# Altium schematic sheet RJ45_Sheet.SchDoc
size 420 x 297 mm; SheetNumber: 11; SheetTotal: 14
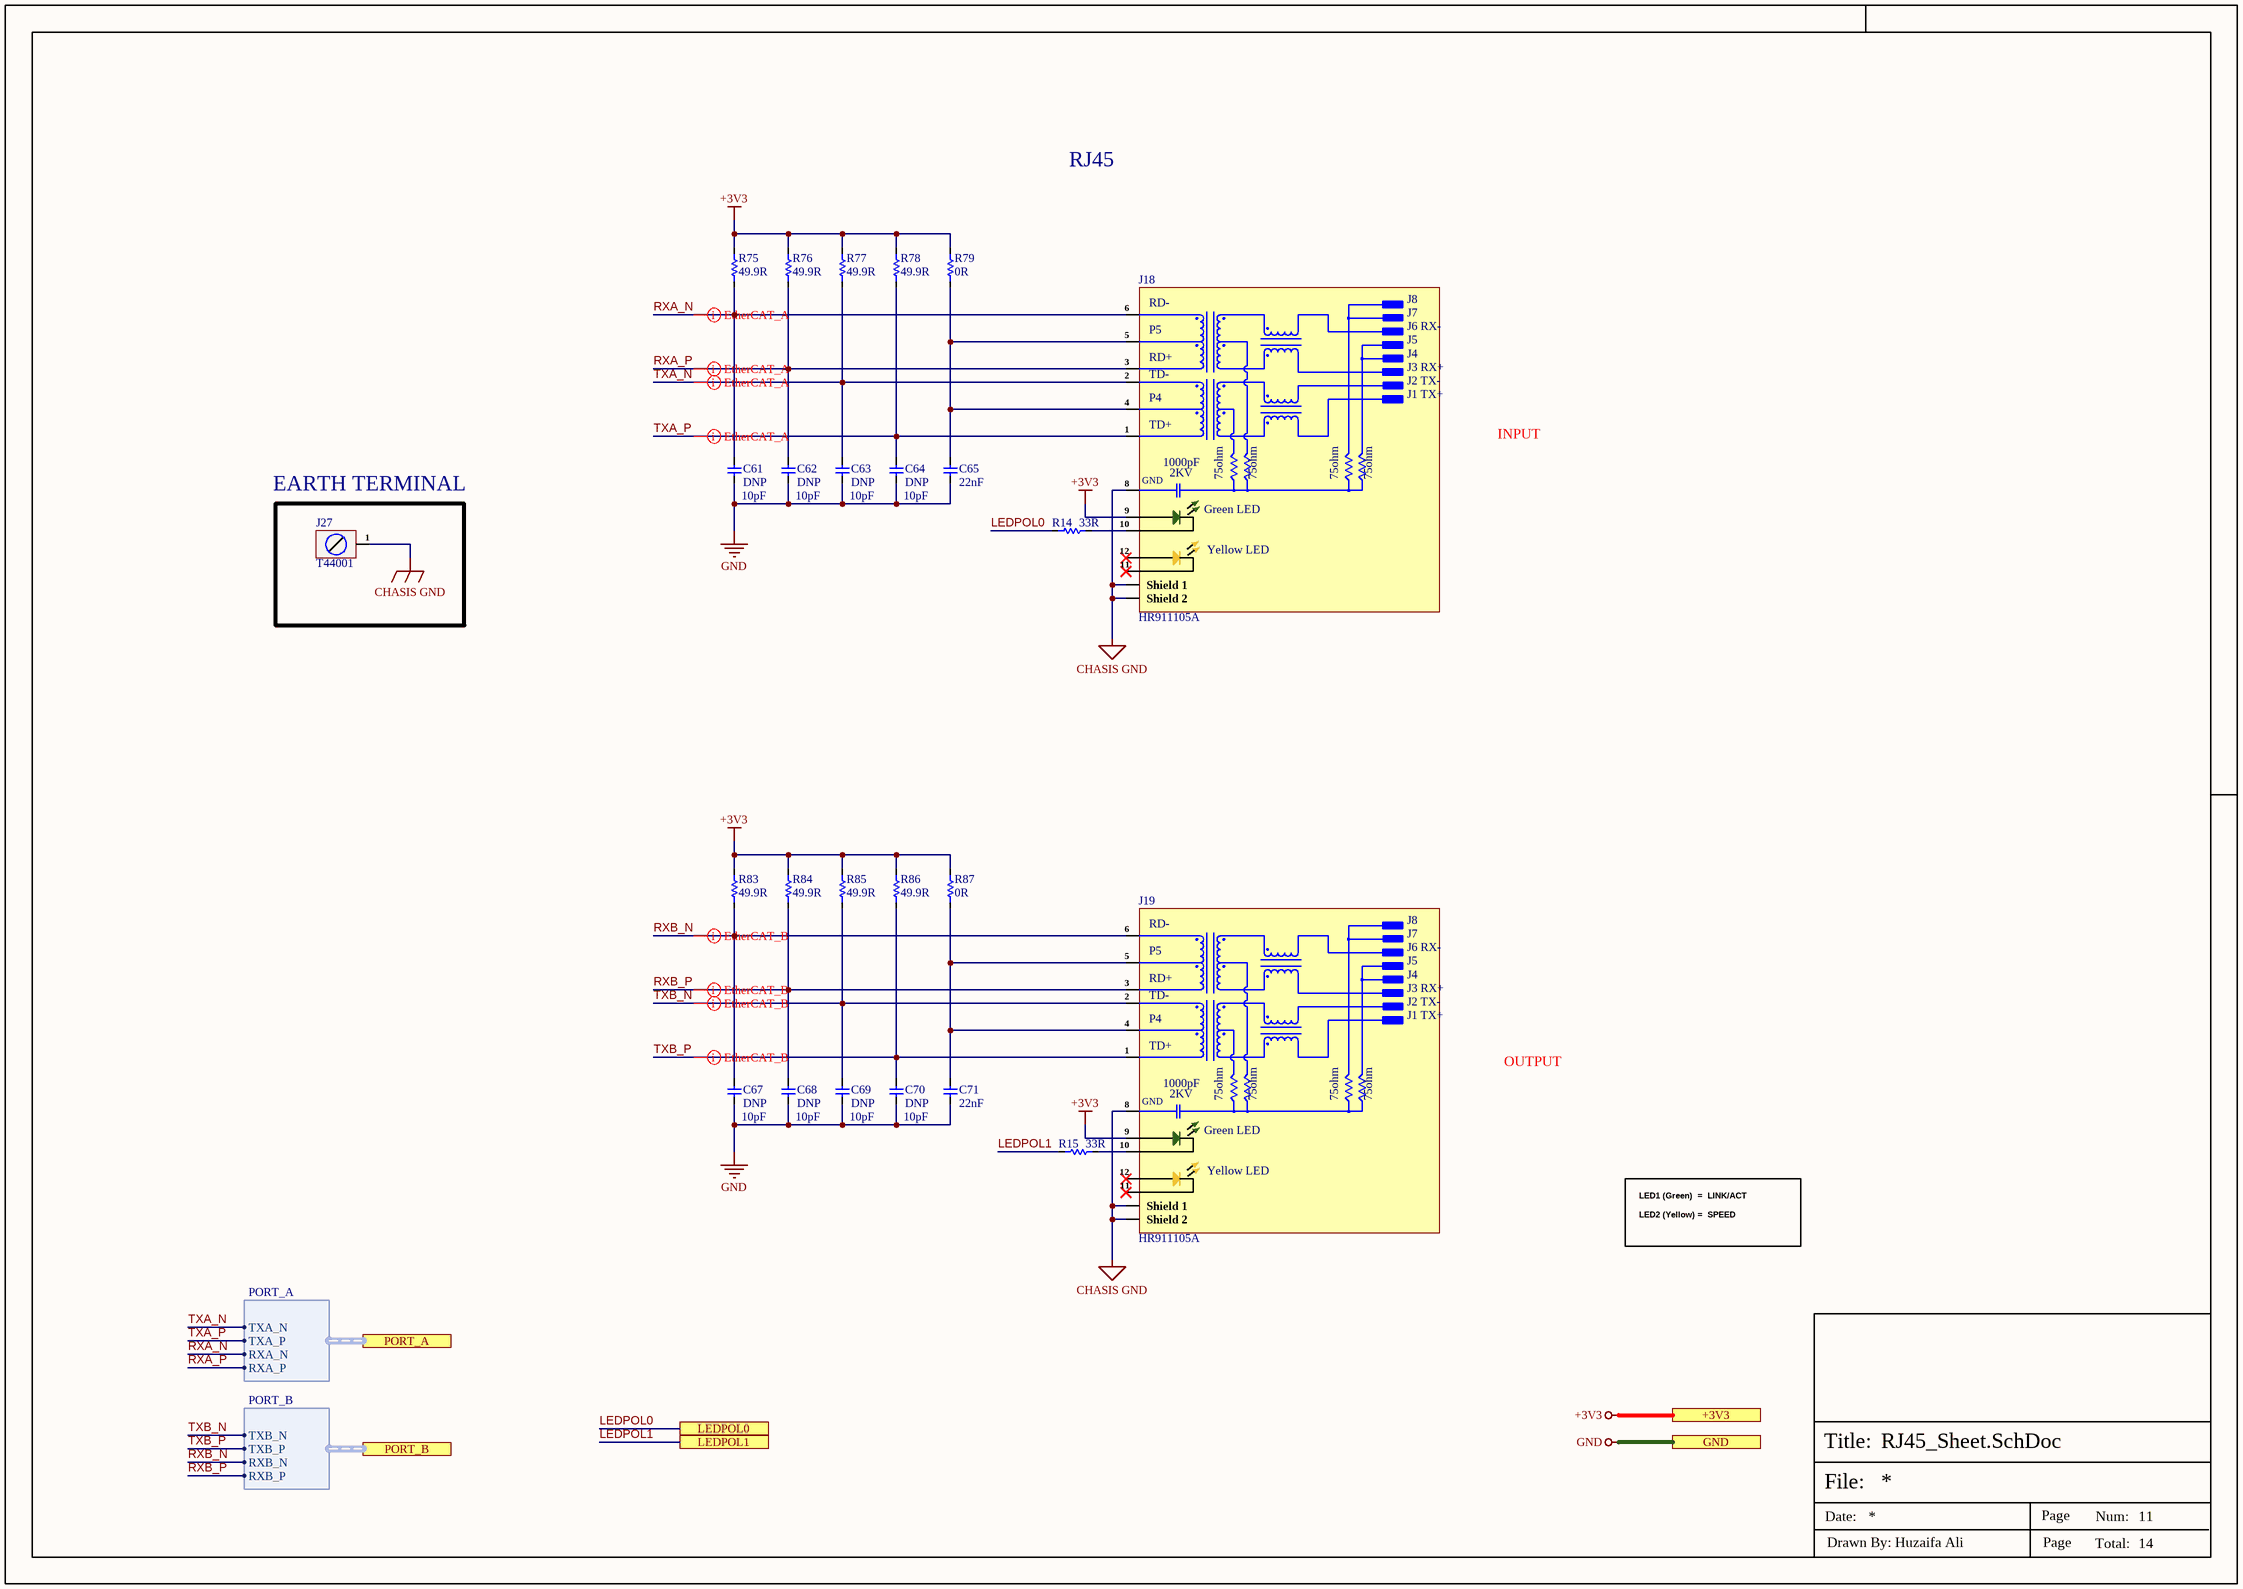
[diagram p0: RJ45_Sheet.SchDoc]

## Parts
C61  DNP  [Cap-0402]
C62  DNP  [Cap-0402]
C63  DNP  [Cap-0402]
C64  DNP  [Cap-0402]
C65  22nF  [Cap-0402]
C67  DNP  [Cap-0402]
C68  DNP  [Cap-0402]
C69  DNP  [Cap-0402]
C70  DNP  [Cap-0402]
C71  22nF  [Cap-0402]
J18  HR911105A  [HR911105A]
J19  HR911105A  [HR911105A]
J27  T44001  [T44001]
R14  33R  [Res-0402]
R15  33R  [Res-0402]
R75  49.9R  [Res-0603]
R76  49.9R  [Res-0603]
R77  49.9R  [Res-0603]
R78  49.9R  [Res-0603]
R79  0R  [Res-0402]
R83  49.9R  [Res-0603]
R84  49.9R  [Res-0603]
R85  49.9R  [Res-0603]
R86  49.9R  [Res-0603]
R87  0R  [Res-0402]

## Ports
+3V3 (see Top_Sheet[1B], CAN_Sheet[5D], Controller_Sheet[5D], EtherCAT_Sheet[5D], GPIO_EXPANDER_Sheet[5D], Power_Sheet[5D], RS485_RS232_Sheet[2D], Stepper_Driver_Sheet1[5D], Stepper_Driver_Sheet2[5D], Stepper_Driver_Sheet3[5D], Stepper_Driver_Sheet4[5D]), GND (see Top_Sheet[1B], CAN_Sheet[5D], Connector_Sheet[5D], Controller_Sheet[5D], DIO_Isolation_Sheet[5D], EtherCAT_Sheet[5D], GPIO_EXPANDER_Sheet[5D], Power_Sheet[5D], RS485_RS232_Sheet[2D], Stepper_Driver_Sheet1[5D], Stepper_Driver_Sheet2[5D], Stepper_Driver_Sheet3[5D], Stepper_Driver_Sheet4[5D]), LEDPOL0 (see Top_Sheet[2B], EtherCAT_Sheet[1D]), LEDPOL1 (see Top_Sheet[2B], EtherCAT_Sheet[1D]), PORT_A (harness PORT_A, see Top_Sheet[2B], EtherCAT_Sheet[2D]), PORT_B (harness PORT_B, see Top_Sheet[2B], EtherCAT_Sheet[2D])

## Harnesses
PORT_A: TXA_N, TXA_P, RXA_N, RXA_P
PORT_B: TXB_N, TXB_P, RXB_N, RXB_P

## Nets
+3V3: J18.9(ANODE) J19.9(ANODE) R75.2 R76.2 R77.2 R78.2 R79.2 R83.2 R84.2 R85.2 R86.2 R87.2 ; port +3V3
CHASIS GND: J18.8(GND) J18.Shield_1 J18.Shield_2 J19.8(GND) J19.Shield_1 J19.Shield_2 J27.1
GND: C61.1 C62.1 C63.1 C64.1 C65.1 C67.1 C68.1 C69.1 C70.1 C71.1 ; port GND
LEDPOL0: R14.1 ; port LEDPOL0
LEDPOL1: R15.1 ; port LEDPOL1
RXA_N: C61.2 J18.6(RD-) R75.1 ; port PORT_A.RXA_N
RXA_P: C62.2 J18.3(RD+) R76.1 ; port PORT_A.RXA_P
RXB_N: C67.2 J19.6(RD-) R83.1 ; port PORT_B.RXB_N
RXB_P: C68.2 J19.3(RD+) R84.1 ; port PORT_B.RXB_P
TXA_N: C63.2 J18.2(TD-) R77.1 ; port PORT_A.TXA_N
TXA_P: C64.2 J18.1(TD+) R78.1 ; port PORT_A.TXA_P
TXB_N: C69.2 J19.2(TD-) R85.1 ; port PORT_B.TXB_N
TXB_P: C70.2 J19.1(TD+) R86.1 ; port PORT_B.TXB_P
NetC65_2: C65.2 J18.4(P4) J18.5(P5) R79.1
NetC71_2: C71.2 J19.4(P4) J19.5(P5) R87.1
NetJ18_10: J18.10(CATHODE) R14.2
NetJ19_10: J19.10(CATHODE) R15.2

Not connected (* = marked no-connect by the designer): J18 11(CATHODE)* 12(ANODE_)*; J19 11(CATHODE)* 12(ANODE_)*

## Layout directives
differential pair; differential pair class EtherCAT_B_Lines; net class EtherCAT_B; rule Matched Net Lengths [Tolerance = 25.4mil]; rule Impedance Constraint [Min = 85.00    Max = 95.00    ]: RXB_N, RXB_P, TXB_N, TXB_P
differential pair; differential pair class EtherCAT_A_Lines; net class EtherCAT_A; rule Matched Net Lengths [Tolerance = 25.4mil]; rule Impedance Constraint [Min = 85.00    Max = 95.00    ]: RXA_N, RXA_P, TXA_N, TXA_P

## Notes on the sheet
- RJ45
- INPUT
- (near J27) EARTH TERMINAL
- 10pF
- OUTPUT
- LED1 (Green)  =  LINK/ACT
  LED2 (Yellow) =  SPEED
- File:
- Title:
- Date:
- Page
- Num:
- Total:
- Drawn By: Huzaifa Ali
- (in symbol HR911105A) J8; J7; J6 RX-; J5; J4; J3 RX+; J2 TX-; J1 TX+; 1000pF; 2KV; 75ohm; Green LED; Yellow LED

## Library data of the parts
C61-C64 C67-C70 = GRM1555C1H100JA01D: CAP CER 10PF 50V C0G/NP0 0402; Manufacturer: Murata; Material: Ceramic; Dielectric: C0G; Tolerance: 5%; Item Type: Capacitor; Supplier: Arrow Electronics; Supplier Part Number: GRM1555C1H100JA01D; Manufacturer Part Number: GRM1555C1H100JA01D; RoHS: Yes; Category: Ceramic Capacitors; Stock: 3860000; Pricing: 10000=0.0034, 50000=0.0027, 100000=0.0023, 250000=0.0021 (USD); Mounting Technology: Surface Mount; Case/Package: 0402; Case Code (Metric): 1005; Case Code (Imperial): 0402; Min Operating Temperature: -55°C; Max Operating Temperature: 125°C; Value: 10pF; Voltage Rating: 50V; Packaging: Tape and Reel; Package Quantity: 1; Voltage Rating (DC): 50V; Termination: SMD/SMT; Series: GRM; Voltage: 50V; Construction: Flat; Length: 1mm; Width: 0.02inch; Height: 0.5mm; Depth: 0.5mm; Thickness: 0.022inch; Radiation Hardening: No; RoHS Compliant: Yes; Lead Free: Lead Free; Reach SVHC Compliant: No; ComponentLink1URL: https://datasheet.ciiva.com/2989/product-2989280.pdf?src-supplier=Avnet; ComponentLink1Description: https://datasheet.ciiva.com/2989/product-2989280.pdf?src-supplier=Avnet; ComponentLink2URL: https://datasheet.ciiva.com/18184/getdatasheetpartid-307234-18184164.pdf?src-supplier=Verical; ComponentLink2Description: https://datasheet.ciiva.com/18184/getdatasheetpartid-307234-18184164.pdf?src-supplier=Verical; ComponentLink3URL: https://datasheet.ciiva.com/29200/453545-da-01-en-vs-kondensator-0402-29200107.pdf?src-supplier=Conrad; ComponentLink3Description: https://datasheet.ciiva.com/29200/453545-da-01-en-vs-kondensator-0402-29200107.pdf?src-supplier=Conrad; ComponentLink4URL: https://datasheet.ciiva.com/7828/1666664-7828812.pdf?src-supplier=Element14; ComponentLink4Description: https://datasheet.ciiva.com/7828/1666664-7828812.pdf?src-supplier=Element14; ComponentLink5URL: https://datasheet.ciiva.com/6271/partnumbering-e-01-6271159.pdf?src-supplier=Digi-Key; ComponentLink5Description: https://datasheet.ciiva.com/6271/partnumbering-e-01-6271159.pdf?src-supplier=Digi-Key; ComponentLink6URL: https://datasheet.ciiva.com/6271/partnumbering-e-01-6271158.pdf?src-supplier=Digi-Key; ComponentLink6Description: https://datasheet.ciiva.com/6271/partnumbering-e-01-6271158.pdf?src-supplier=Digi-Key; ComponentLink7URL: https://datasheet.ciiva.com/6271/partnumbering-e-01-6271068.pdf?src-supplier=Digi-Key; ComponentLink7Description: https://datasheet.ciiva.com/6271/partnumbering-e-01-6271068.pdf?src-supplier=Digi-Key; LCSC Part Number: C76946
C65 C71 = CC0402JRX7R7BB223: CAP CER 0.022UF 16V X7R 0402; Manufacturer: Yageo; Tolerance: 5%; Item Type: Capacitor; Supplier: Digikey; Supplier Part Number: 311-3758-1-ND; Manufacturer Part Number: CC0402JRX7R7BB223; RoHS: Yes; Category: Ceramic Capacitors; Stock: 4203; Pricing: 1=0.1, 10=0.033, 50=0.0192, 100=0.0149, 500=0.0112, 1000=0.0088, 2500=0.008, 5000=0.00736 (USD); Mounting Technology: Surface Mount; Case/Package: 0402; Case Code (Imperial): 0402; Case Code (Metric): 1005; Weight: 2.3E-05oz; Min Operating Temperature: -55°C; Max Operating Temperature: 125°C; Value: 22nF; Packaging: Tape and Reel; Voltage Rating: 16V; Voltage Rating (DC): 16V; Dielectric: X7R; Termination: SMD/SMT; Series: CC; Length: 0.039inch; Width: 0.5mm; Thickness: 0.022inch; RoHS Compliant: Yes; Halogen Free: 5694HalogenFree; Lead Free: 5697LeadFree; ComponentLink1URL: https://datasheet.ciiva.com/13264/upy-gphc-x7r-6-3v-to-50v-8-12304-13264039.pdf?src-supplier=Mouser; ComponentLink1Description: https://datasheet.ciiva.com/13264/upy-gphc-x7r-6-3v-to-50v-8-12304-13264039.pdf?src-supplier=Mouser; LCSC Part Number: C541459
J18 J19 = HR911105A: RJ45 RJReceptacle 1 WithLED Plugin Ethernet Connectors/Modular Connectors (RJ45 RJ11) ROHS; Manufacturer: HANRUN; Item Type: RJ45 Connector; Manufacturer Part Number: HR911105A; Package: Plugin; LCSC Part Number: C12074; ComponentLink1Description: LCSC; ComponentLink1URL: https://www.lcsc.com/product-detail/Ethernet-Connectors-Modular-Connectors-RJ45-RJ11_HANRUN-Zhongshan-HanRun-Elec-HR911105A_C12074.html
J27 = T44001: M4 Plugin PCB Welding Terminal ROHS; Manufacturer: XFCN; Manufacturer Part Number: T44001; Package: Plugin; ComponentLink1Description: LCSC; ComponentLink1URL: *
R14 R15 = RC0402FR-0733RL: RES 33 OHM 1% 1/16W 0402; Manufacturer: Yageo; Power Rating: 62.5mW; Voltage Rating: 50V; Temperature Coefficient: 100ppm/°C; Max Power Dissipation: 63mW; Supplier 1: Mouser; Manufacturer Part Number: RC0402FR-0733RL; RoHS: Yes; Category: Chip SMD Resistors; Stock 1: 1843488; Pricing 1: 1=0.10000, 10=0.01200, 50=0.01200, 100=0.00500, 1000=0.00300, 10000=0.00100 (USD); Case/Package: 0402; Number of Pins: 2; Case Code (Imperial): 0402; Case Code (Metric): 1005; Size Code: 0402; Min Operating Temperature: -55°C; Max Operating Temperature: 155°C; Resistor Type: Thick Film; Resistance: 33R; Tolerance: 1%; Packaging: Tape and Reel; Voltage Rating (DC): 50V; Package Quantity: 10000; Termination: SMD/SMT; Features: Moisture Resistant; Series: RC; Number of Terminations: 2; Resistance Tolerance: 1%; Construction: Rectangular; Technology: THICK FILM; Length: 1mm; Width: 0.5mm; Height: 0.35mm; Depth: 0.5mm; RoHS Compliant: Yes; REACH SVHC: Unknown; Military Standard: Not; Lead Free: Lead Free; ComponentLink1URL: https://datasheet.ciiva.com/11819/0900766b80c66297-11819487.pdf?src-supplier=RSComponents; ComponentLink1Description: https://datasheet.ciiva.com/11819/0900766b80c66297-11819487.pdf?src-supplier=RSComponents; ComponentLink2URL: https://datasheet.ciiva.com/24070/pyu-rc0402-51-rohs-l-6-r-8721-24070077.pdf?src-supplier=Mouser; ComponentLink2Description: https://datasheet.ciiva.com/24070/pyu-rc0402-51-rohs-l-6-r-8721-24070077.pdf?src-supplier=Mouser; ComponentLink3URL: https://datasheet.ciiva.com/7849/1018594-7849967.pdf?src-supplier=Element14; ComponentLink3Description: https://datasheet.ciiva.com/7849/1018594-7849967.pdf?src-supplier=Element14; ComponentLink4URL: https://datasheet.ciiva.com/7849/1018594-7849966.pdf?src-supplier=Element14; ComponentLink4Description: https://datasheet.ciiva.com/7849/1018594-7849966.pdf?src-supplier=Element14; ComponentLink5URL: https://datasheet.ciiva.com/15189/getdatasheetpartid-329253-15189431.pdf?src-supplier=Verical; ComponentLink5Description: https://datasheet.ciiva.com/15189/getdatasheetpartid-329253-15189431.pdf?src-supplier=Verical; ComponentLink6URL: https://datasheet.ciiva.com/17070/pyu-rc0402-51-rohs-l-6-r-17070335.pdf?src-supplier=Future+Electronics; ComponentLink6Description: https://datasheet.ciiva.com/17070/pyu-rc0402-51-rohs-l-6-r-17070335.pdf?src-supplier=Future+Electronics; Supplier Part Number 1: 603-RC0402FR-0733RL; LCSC Part Number: C138002
R75-R78 R83-R86 = RC0603FR-0749R9L: RES 49.9 OHM 1% 1/10W 0603; Manufacturer: Yageo; Temperature Coefficient: 100ppm/°C; Voltage Rating (DC): 50V; Power Rating: 100mW; Item Type: Resistor; Supplier 1: Arrow Electronics; Manufacturer Part Number: RC0603FR-0749R9L; RoHS: Yes; Category: Chip SMD Resistors; Stock 1: 2075000; Pricing 1: 5000=0.00280 (USD); Case/Package: 0603; Number of Pins: 2; Case Code (Imperial): 0603; Case Code (Metric): 1608; Size Code: 0603; Min Operating Temperature: -55°C; Max Operating Temperature: 155°C; Tolerance: 1%; Resistance: 49.9R; Resistor Type: Thick Film; Packaging: Tape and Reel; Voltage Rating: 50V; Termination: SMD/SMT; Features: Moisture Resistant; Series: RC; Max Power Dissipation: 100mW; Number of Terminations: 2; Construction: Rectangular; Resistance Tolerance: 1%; Technology: THICK FILM; Length: 1.6mm; Height: 0.45mm; Depth: 0.8mm; Lead Free: Lead Free; REACH SVHC: No SVHC; Military Standard: Not; RoHS Compliant: Yes; ComponentLink1URL: https://datasheet.ciiva.com/11808/0900766b80f96399-11808223.pdf?src-supplier=RSComponents; ComponentLink1Description: https://datasheet.ciiva.com/11808/0900766b80f96399-11808223.pdf?src-supplier=RSComponents; ComponentLink2URL: https://datasheet.ciiva.com/22747/443971-22747527.pdf?src-supplier=Element14; ComponentLink2Description: https://datasheet.ciiva.com/22747/443971-22747527.pdf?src-supplier=Element14; ComponentLink3URL: https://datasheet.ciiva.com/15189/getdatasheetpartid-325421-15189750.pdf?src-supplier=Verical; ComponentLink3Description: https://datasheet.ciiva.com/15189/getdatasheetpartid-325421-15189750.pdf?src-supplier=Verical; Supplier Part Number 1: RC0603FR-0749R9L; LCSC Part Number: C114625
R79 R87 = AC0402FR-070RL: RESISTOR 0402 JUMPER ZERO OHM; Manufacturer: Yageo; Voltage Rating: 50V; Power Rating: 62.5mW; Tolerance: 1%; Temperature Coefficient: 200ppm/°C; Supplier: Digi-Key; Supplier Part Number: 13-AC0402FR-070RLDKR-ND; Manufacturer Part Number: AC0402FR-070RL; RoHS: Yes; Category: Chip SMD Resistors; Stock: 337140; Pricing: 1=0.1, 10=0.017, 25=0.0132, 50=0.01, 100=0.0071, 250=0.00568, 500=0.00454, 1000=0.00335, 5000=0.0024 (USD); Case/Package: 0402; Case Code (Imperial): 0402; Case Code (Metric): 1005; Min Operating Temperature: -55°C; Max Operating Temperature: 155°C; Value: 0R; Packaging: Tape and Reel; Termination: SMD/SMT; Series: AC; Height: 370um; ComponentLink1URL: https://datasheet.ciiva.com/12656/pyu-ac-51-rohs-l-2-12656734.pdf?src-supplier=Mouser; ComponentLink1Description: https://datasheet.ciiva.com/12656/pyu-ac-51-rohs-l-2-12656734.pdf?src-supplier=Mouser; LCSC Part Number: C226739; Item Type: Resistor; ComponentLink2Description: LCSC; ComponentLink2URL: https://www.lcsc.com/product-detail/Chip-Resistor-Surface-Mount_YAGEO-AC0402FR-070RL_C226739.html